# EAGLE design tfcart (EAGLE 9.6.2)
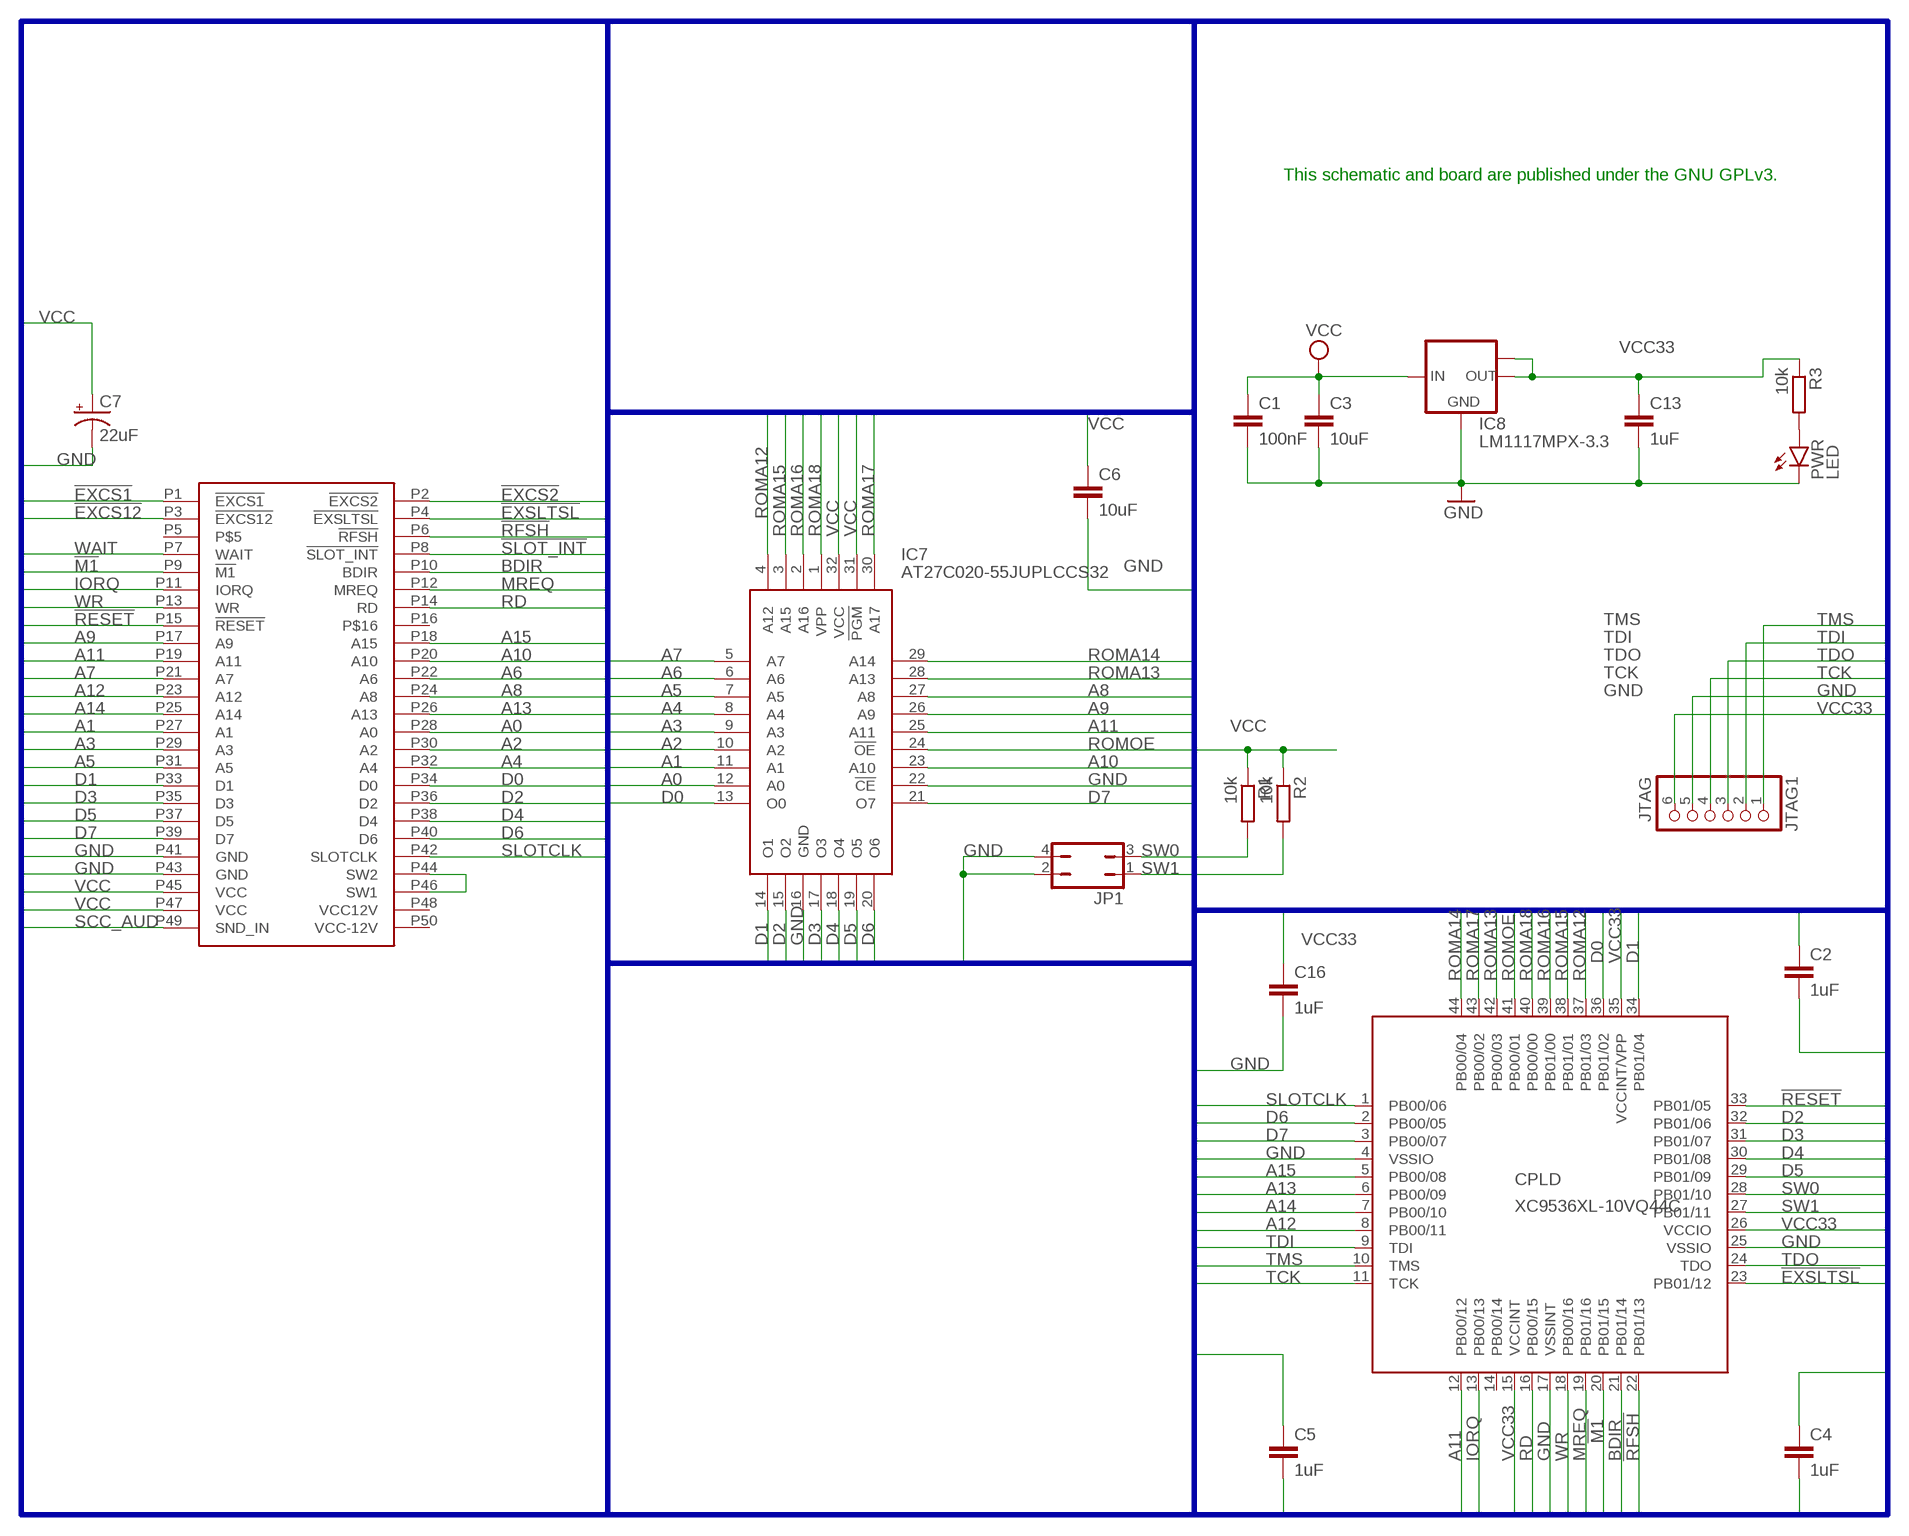
[diagram p0: schematic, sheet 1]

## Parts
C1  100nF  C-EUC1206  [C1206]
C2  1uF  CC0603  [C0603]
C3  10uF  CC0603  [C0603]
C4  1uF  CC0603  [C0603]
C5  1uF  CC0603  [C0603]
C6  10uF  CC0603  [C0603]
C7  22uF  CPOL-USB  [PANASONIC_B]
C13  1uF  C-EUC1206  [C1206]
C16  1uF  CC0603  [C0603]
CN1  MSX_CART  [MSX_CART]
CPLD  XC9536XL-10VQ44C  XC9536_44VQ  [SQFP-S-10X10-44]
IC7  AT27C020-55JUPLCCS32  [PLCC-S32]
IC8  LM1117MPX-3.3  [SOT223]
JP1  JP2Q  [JP2Q]
JTAG1  JTAG  HEADER-1X6ROUND  [1X06_ROUND]
PWR  LED  LEDSML0805  [SML0805]
R1  10k  R-EU_R0603  [R0603]
R2  10k  R-EU_R0603  [R0603]
R3  10k  R-EU_R0603  [R0603]

## Nets
!EXCS1: CN1.P1(!EXCS1)
!EXCS2: CN1.P2(!EXCS2)
!EXCS12: CN1.P3(!EXCS12)
!EXSLTSL: CN1.P4(!EXSLTSL) CPLD.23(PB01/12)
!M1: CN1.P9(!M1) CPLD.20(PB01/15)
!RESET: CN1.P15(!RESET) CPLD.33(PB01/05)
!RFSH: CN1.P6(!RFSH) CPLD.22(PB01/13)
!SLOT_INT: CN1.P8(!SLOT_INT)
A0: CN1.P28(A0) IC7.12(A0)
A1: CN1.P27(A1) IC7.11(A1)
A2: CN1.P30(A2) IC7.10(A2)
A3: CN1.P29(A3) IC7.9(A3)
A4: CN1.P32(A4) IC7.8(A4)
A5: CN1.P31(A5) IC7.7(A5)
A6: CN1.P22(A6) IC7.6(A6)
A7: CN1.P21(A7) IC7.5(A7)
A8: CN1.P24(A8) IC7.27(A8)
A9: CN1.P17(A9) IC7.26(A9)
A10: CN1.P20(A10) IC7.23(A10)
A11: CN1.P19(A11) CPLD.12(PB00/12) IC7.25(A11)
A12: CN1.P23(A12) CPLD.8(PB00/11)
A13: CN1.P26(A13) CPLD.6(PB00/09)
A14: CN1.P25(A14) CPLD.7(PB00/10)
A15: CN1.P18(A15) CPLD.5(PB00/08)
BDIR: CN1.P10(BDIR) CPLD.21(PB01/14)
D0: CN1.P34(D0) CPLD.36(PB01/02) IC7.13(O0)
D1: CN1.P33(D1) CPLD.34(PB01/04) IC7.14(O1)
D2: CN1.P36(D2) CPLD.32(PB01/06) IC7.15(O2)
D3: CN1.P35(D3) CPLD.31(PB01/07) IC7.17(O3)
D4: CN1.P38(D4) CPLD.30(PB01/08) IC7.18(O4)
D5: CN1.P37(D5) CPLD.29(PB01/09) IC7.19(O5)
D6: CN1.P40(D6) CPLD.2(PB00/05) IC7.20(O6)
D7: CN1.P39(D7) CPLD.3(PB00/07) IC7.21(O7)
GND: C1.2 C2.2 C3.2 C4.2 C5.2 C6.2 C7.- C13.2 C16.2 CN1.P41(GND) CN1.P43(GND) CPLD.4(VSSIO) CPLD.17(VSSINT) CPLD.25(VSSIO) IC7.16(GND) IC7.22(!CE) IC8.1(GND) JP1.2 JP1.4 JTAG1.5 PWR.C
IORQ: CN1.P11(IORQ) CPLD.13(PB00/13)
MREQ: CN1.P12(MREQ) CPLD.19(PB01/16)
N$2: CN1.P44(SW2) CN1.P46(SW1)
N$18: PWR.A R3.2
RD: CN1.P14(RD) CPLD.16(PB00/15)
ROMA12: CPLD.37(PB01/03) IC7.4(A12)
ROMA13: CPLD.42(PB00/03) IC7.28(A13)
ROMA14: CPLD.44(PB00/04) IC7.29(A14)
ROMA15: CPLD.38(PB01/01) IC7.3(A15)
ROMA16: CPLD.39(PB01/00) IC7.2(A16)
ROMA17: CPLD.43(PB00/02) IC7.30(A17)
ROMA18: CPLD.40(PB00/00) IC7.1(VPP)
ROMOE: CPLD.41(PB00/01) IC7.24(!OE)
SCC_AUD: CN1.P49(SND_IN)
SLOTCLK: CN1.P42(SLOTCLK) CPLD.1(PB00/06)
SW0: CPLD.28(PB01/10) JP1.3 R1.2
SW1: CPLD.27(PB01/11) JP1.1 R2.2
TCK: CPLD.11(TCK) JTAG1.4
TDI: CPLD.9(TDI) JTAG1.2
TDO: CPLD.24(TDO) JTAG1.3
TMS: CPLD.10(TMS) JTAG1.1
VCC: C1.1 C3.1 C6.1 C7.+ CN1.P45(VCC) CN1.P47(VCC) IC7.31(!PGM) IC7.32(VCC) IC8.3(IN) R1.1 R2.1
VCC33: C2.1 C4.1 C5.1 C13.1 C16.1 CPLD.15(VCCINT) CPLD.26(VCCIO) CPLD.35(VCCINT/VPP) IC8.2(OUT) IC8.TAB(OUT1) JTAG1.6 R3.1
WAIT: CN1.P7(WAIT)
WR: CN1.P13(WR) CPLD.18(PB00/16)
Unconnected: CN1.P5 CN1.P16 CN1.P48(VCC12V) CN1.P50(VCC-12V) CPLD.14(PB00/14)

## Buses
A[0..15],BDIR,D[0..7],!EXCS[1..2],!EXCS12,!EXSLTSL,GND,HALT,!INT,IORQ,!M1,MREQ,RD,!RESET,!RFSH,ROMA[12..18],ROMCE,ROMOE,SCC_AUD,SLOTCLK,SLOTCLK_CLEAN,!SLOT_INT,SW[0..1],TCK,TDI,TDINT,TDO,TMS,VCC,VCC-12V,VCC12V,VCC33,WAIT,WR

## Notes on the sheet
- This schematic and board are published under the GNU GPLv3.

## Library data of the parts
C1 C13 = rcl:C-EU: CAPACITOR, European symbol; SPICEPREFIX: C
C2-C6 C16 = eagle-ltspice:C: CAPACITOR, European symbol; SPICEMODEL: NONE; SPICEPREFIX: C
C7 = rcl:CPOL-US: POLARIZED CAPACITOR, American symbol; SPICEPREFIX: C
CN1 = Amiga:MSX_CART: Expansion Port for CDTV and A570
CPLD = xilinx-xc9:XC9536_44VQ: xc9536_pc44 XC9500 In-System Programmable CPLD Family Auto generated by make-symbol-device-package-bsdl.ulp Rev. 34 Source: xc9536_vq44.bsd; MPN: XC9536-15VQG44C; OC_FARNELL: 1193227; OC_NEWARK: 98K3377
IC7 = SamacSys_Parts:AT27C020-55JU: AT27C020-55JU, OTP EPROM Memory 2Mbit 256K x 8 bit 55ns, 5.0V 32-Pin PLCC Source: Datasheet
IC8 = lm1117:LM1117MPX-*
JP1 = jumper:JP2Q: JUMPER
JTAG1 = microbuilder:HEADER-1X6: PIN HEADER
PWR = led:LED: LED OSRAM: - CHIPLED LG R971, LG N971, LY N971, LG Q971, LY Q971, LO R971, LY R971 LH N974, LH R974 LS Q976, LO Q976, LY Q976 LO Q996 - Hyper CHIPLED LW Q18S LB Q993, LB Q99A, LB R99A - SideLED LS A670, LO A670, LY A670, LG A670, LP A670 LB A673, LV A673, LT A673, LW A673 LH A674 LY A675 LS A676, LA A676, LO A676, LY A676, LW A676 LS A679, LY A679, LG A679 - Hyper Micro SIDELED® LS Y876, LA Y876, LO Y876, LY Y876 LT Y87S - SmartLED LW L88C, LW L88S LB L89C, LB L89S, LG L890 LS L89K, LO L89K, LY L89K LS L896, LA L896, LO L896, LY L896 - TOPLED LS T670, LO T670, LY T670, LG T670, LP T670 LSG T670, LSP T670, LSY T670, LOP T670, LYG T670 LG T671, LOG T671, LSG T671 LB T673, LV T673, LT T673, LW T673 LH T674 LS T676, LA T676, LO T676, LY T676, LB T676, LH T676, LSB T676, LW T676 LB T67C, LV T67C, LT T67C, LS T67K, LO T67K, LY T67K, LW E67C LS E67B, LA E67B, LO E67B, LY E67B, LB E67C, LV E67C, LT E67C LW T67C LS T679, LY T679, LG T679 LS T770, LO T770, LY T770, LG T770, LP T770 LB T773, LV T773, LT T773, LW T773 LH T774 LS E675, LA E675, LY E675, LS T675 LS T776, LA T776, LO T776, LY T776, LB T776 LHGB T686 LT T68C, LB T68C - Hyper Mini TOPLED® LB M676 - Mini TOPLED Santana® LG M470 LS M47K, LO M47K, LY M47K Source: http://www.osram.convergy.de LUXEON: - LUMILED® LXK2-PW12-R00, LXK2-PW12-S00, LXK2-PW14-U00, LXK2-PW14-V00 LXK2-PM12-R00, LXK2-PM12-S00, LXK2-PM14-U00 LXK2-PE12-Q00, LXK2-PE12-R00, LXK2-PE12-S00, LXK2-PE14-T00, LXK2-PE14-U00 LXK2-PB12-K00, LXK2-PB12-L00, LXK2-PB12-M00, LXK2-PB14-N00, LXK2-PB14-P00, LXK2-PB14-Q00 LXK2-PR12-L00, LXK2-PR12-M00, LXK2-PR14-Q00, LXK2-PR14-R00 LXK2-PD12-Q00, LXK2-PD12-R00, LXK2-PD12-S00 LXK2-PH12-R00, LXK2-PH12-S00 LXK2-PL12-P00, LXK2-PL12-Q00, LXK2-PL12-R00 Source: www.luxeon.com KINGBRIGHT: KA-3528ASYC Source: www.kingbright.com
R1-R3 = rcl:R-EU_: RESISTOR, European symbol; SPICEPREFIX: R

## Net classes
0 default: width 0.152 mm, drill 0.3 mm, clearance 0.152 mm

## Board
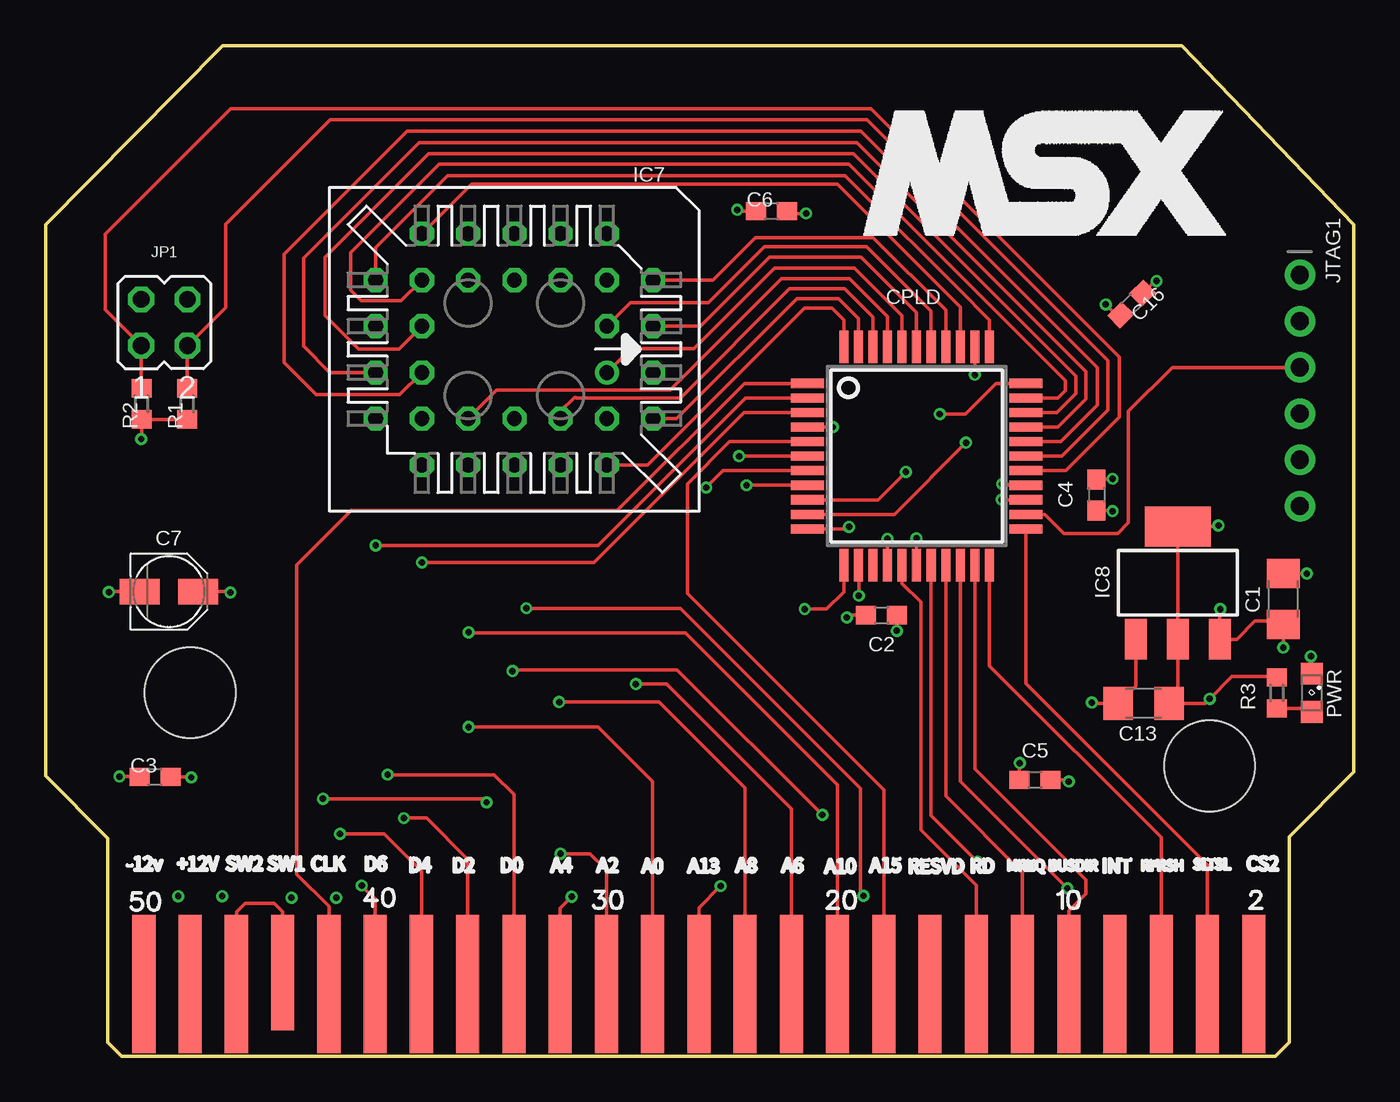
[diagram p1: board, top side]
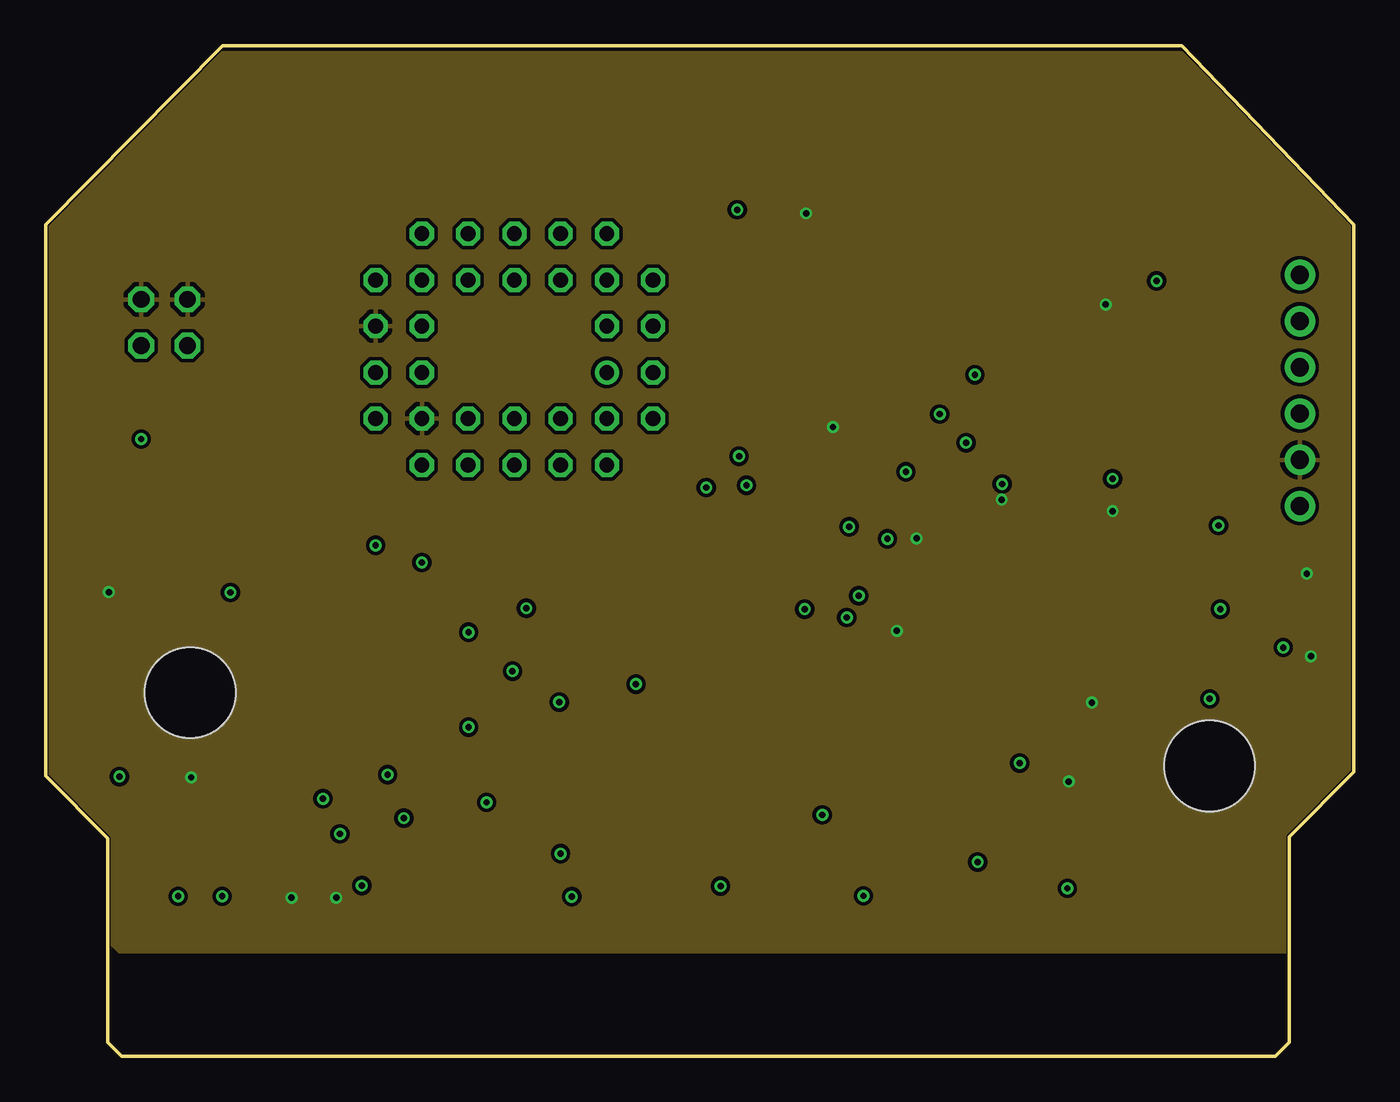
[diagram p2: board, inner layer Route2]
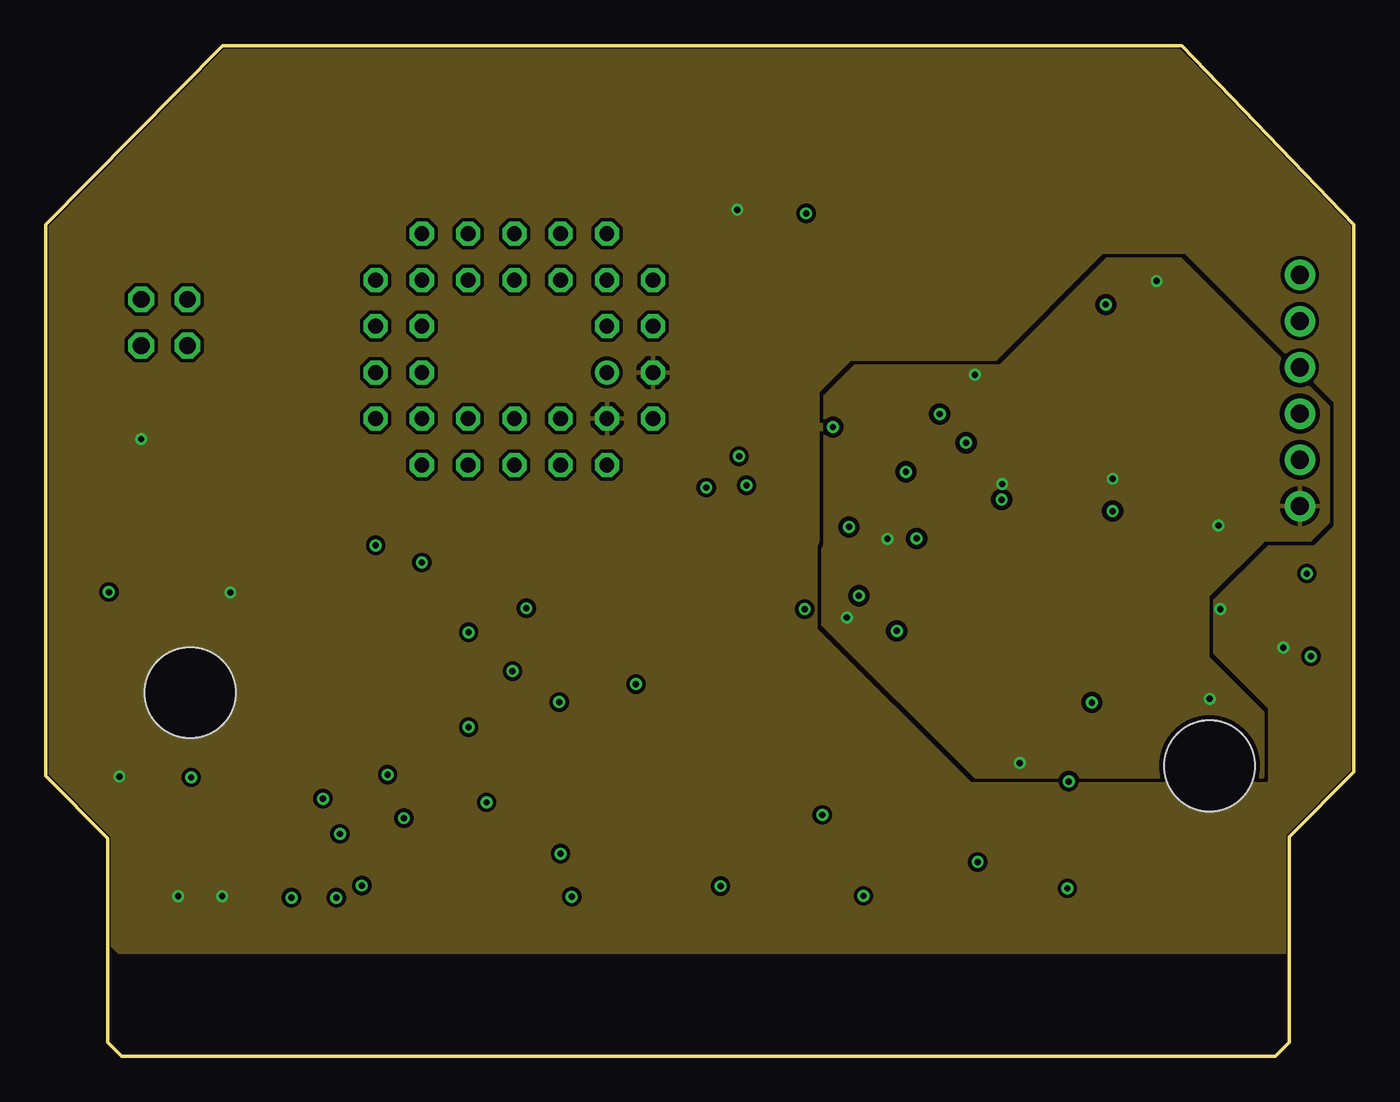
[diagram p3: board, inner layer Route15]
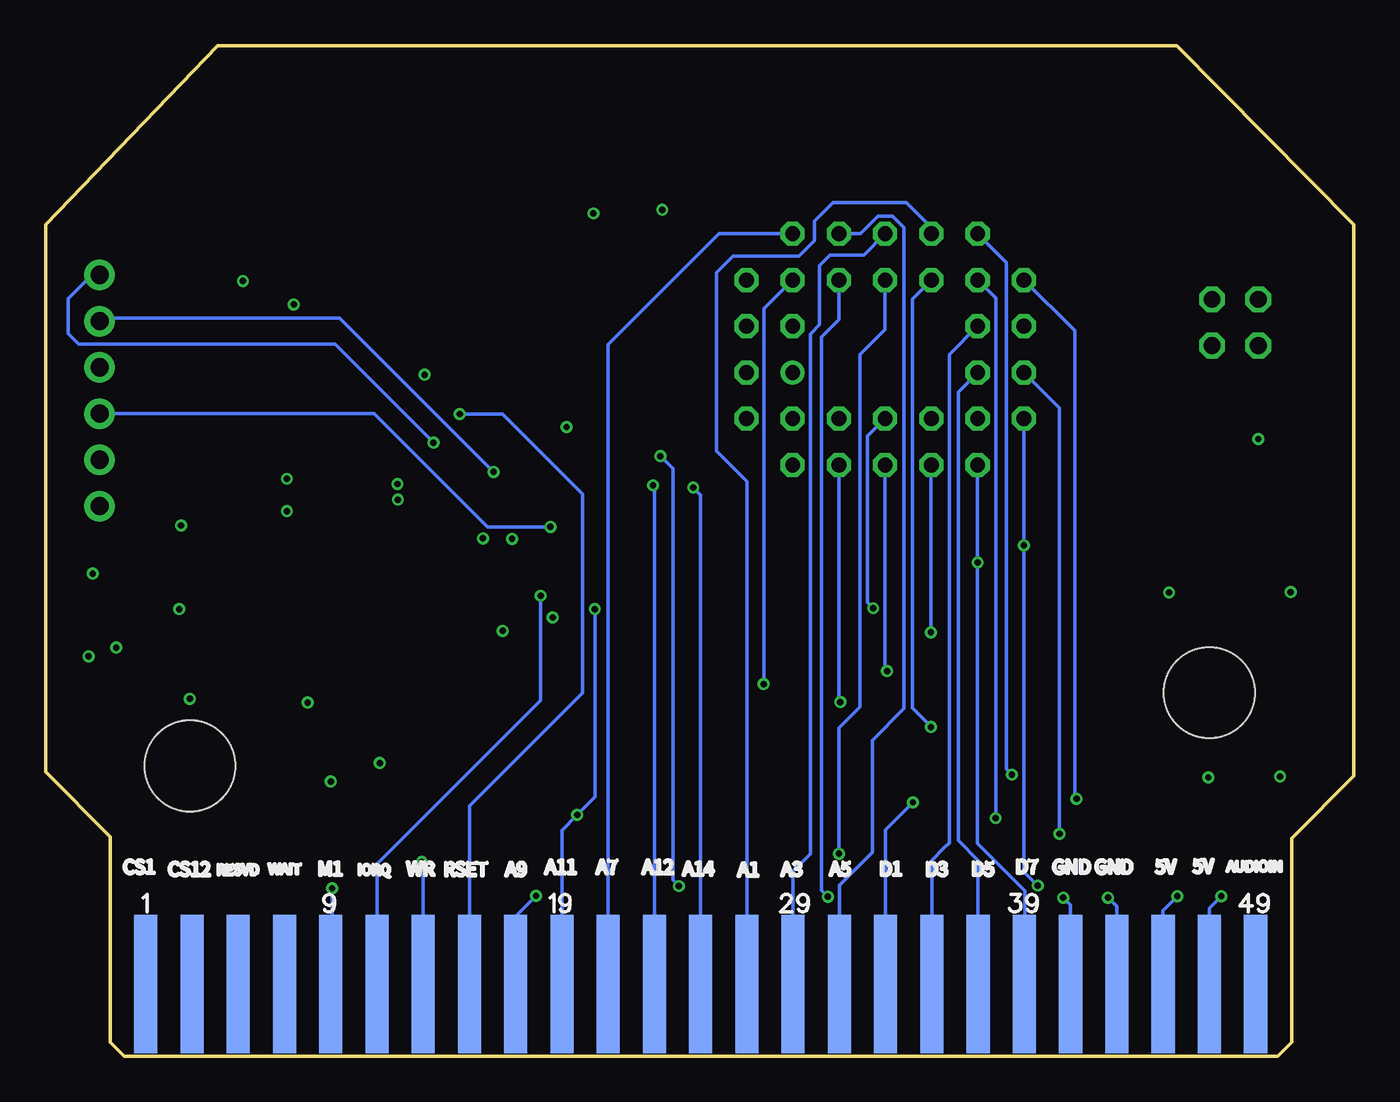
[diagram p4: board, bottom side, seen from below]

Size 71.88 x 55.53 mm. Coordinates in mm from the lower left corner, seen from the top.
Outline: 0,45.69 9.73,55.53 62.43,55.53 71.88,45.69 71.88,15.62 68.33,12.06 68.33,0.76 67.56,0 4.19,0 3.43,0.76 3.43,11.96 0,15.39 0,45.69
Copper layers (1*2*15*16): Top 0.035mm / dielectric 1.5mm / Route2 0.0175mm / dielectric 1.1mm / Route15 0.0175mm / dielectric 0.2mm / Bottom 0.035mm
Design rules "dirt_cheap_dirty_boards.v1 (1) *": minimum track width 6mil, minimum drill 12mil, track to track 8mil, track to pad 8mil, pad to pad 8mil, via to via 8mil, smd to smd 0mil, copper to edge 2mil, drill to drill 10mil, minimum pad ring 10mil, minimum via ring 6mil, stop-mask expansion 2mil, vias tented up to drill 25mil, thermal gap 10mil
Holes 5 mm at 7.95,19.97 63.95,15.96

### Footprints (pad centres in the part's own frame; a part is rotated, then mirrored left to right if it is on the bottom)
C1206 = smd 1.6 x 1.8: 1 -1.4,0; 2 1.4,0
C0603 = smd 1.1 x 1: 1 -0.85,0; 2 0.85,0
PANASONIC_B = smd 2.2 x 1.4: + 1.6,0; - -1.6,0
MSX_CART = smd 1.27 x 7.62 bottom: P1 63.5,5.08; P3 60.96,5.08; P5 58.42,5.08; P7 55.88,5.08; P9 53.34,5.08; P11 50.8,5.08; P13 48.26,5.08; P15 45.72,5.08; P17 43.18,5.08; P19 40.64,5.08; P21 38.1,5.08; P23 35.56,5.08; P25 33.02,5.08; P27 30.48,5.08; P29 27.94,5.08; P31 25.4,5.08; P33 22.86,5.08; P35 20.32,5.08; P37 17.78,5.08; P39 15.24,5.08; P41 12.7,5.08; P43 10.16,5.08; P45 7.62,5.08; P47 5.08,5.08; P49 2.54,5.08 | smd 1.27 x 7.62: P2 63.5,5.08; P4 60.96,5.08; P6 58.42,5.08; P8 55.88,5.08; P10 53.34,5.08; P12 50.8,5.08; P14 48.26,5.08; P16 45.72,5.08; P18 43.18,5.08; P20 40.64,5.08; P22 38.1,5.08; P24 35.56,5.08; P26 33.02,5.08; P28 30.48,5.08; P30 27.94,5.08; P32 25.4,5.08; P34 22.86,5.08; P36 20.32,5.08; P38 17.78,5.08; P40 15.24,5.08; P42 12.7,5.08; P46 7.62,5.08; P48 5.08,5.08; P50 2.54,5.08 | smd 1.27 x 6.35: P44 10.16,5.715
SQFP-S-10X10-44 = smd 0.5 x 1.8: 1 -4,-6; 2 -3.2,-6; 3 -2.4,-6; 4 -1.6,-6; 5 -0.8,-6; 6 0,-6; 7 0.8,-6; 8 1.6,-6; 9 2.4,-6; 10 3.2,-6; 11 4,-6; 23 4,6; 24 3.2,6; 25 2.4,6; 26 1.6,6; 27 0.8,6; 28 0,6; 29 -0.8,6; 30 -1.6,6; 31 -2.4,6; 32 -3.2,6; 33 -4,6 | smd 1.8 x 0.5: 12 6,-4; 13 6,-3.2; 14 6,-2.4; 15 6,-1.6; 16 6,-0.8; 17 6,0; 18 6,0.8; 19 6,1.6; 20 6,2.4; 21 6,3.2; 22 6,4; 34 -6,4; 35 -6,3.2; 36 -6,2.4; 37 -6,1.6; 38 -6,0.8; 39 -6,0; 40 -6,-0.8; 41 -6,-1.6; 42 -6,-2.4; 43 -6,-3.2; 44 -6,-4
PLCC-S32 = drill 0.813: 1 1.27,5.08 | drill 0.813 octagon: 2 -1.27,7.62; 3 -1.27,5.08; 4 -3.81,7.62; 5 -6.35,5.08; 6 -3.81,5.08; 7 -6.35,2.54; 8 -3.81,2.54; 9 -6.35,0; 10 -3.81,0; 11 -6.35,-2.54; 12 -3.81,-2.54; 13 -6.35,-5.08; 14 -3.81,-7.62; 15 -3.81,-5.08; 16 -1.27,-7.62; 17 -1.27,-5.08; 18 1.27,-7.62; 19 1.27,-5.08; 20 3.81,-7.62; 21 6.35,-5.08; 22 3.81,-5.08; 23 6.35,-2.54; 24 3.81,-2.54; 25 6.35,0; 26 3.81,0; 27 6.35,2.54; 28 3.81,2.54; 29 6.35,5.08; 30 3.81,7.62; 31 3.81,5.08; 32 1.27,7.62
SOT223 = smd 1.219 x 2.235: 1 -2.311,-3.099; 2 0,-3.099; 3 2.311,-3.099 | smd 3.6 x 2.2: TAB 0,3.099
JP2Q = drill 0.914 octagon: 1 -1.27,-1.27; 2 -1.27,1.27; 3 1.27,-1.27; 4 1.27,1.27
1X06_ROUND = drill 1 pad 1.676: 1 -6.35,0; 2 -3.81,0; 3 -1.27,0; 4 1.27,0; 5 3.81,0; 6 6.35,0
SML0805 = smd 1.2 x 1.2: A 1.05,0; C -1.05,0
R0603 = smd 1 x 1.1: 1 -0.85,0; 2 0.85,0

### Placement (x,y rotation side)
C1  68,25.12 90 top
C2  45.92,24.23 0 top
C3  6.02,15.34 0 top
C4  57.73,30.84 270 top
C5  54.36,15.19 0 top
C6  39.88,46.43 0 top
C7  6.78,25.53 0 top
C13  60.33,19.38 180 top
C16  59.66,41.33 225 top
CN1  2.87,-1.12 0 top
CPLD  47.85,32.97 270 top
IC7  25.76,38.84 270 top
IC8  62.2,26.01 0 top
JP1  6.53,40.31 0 top
JTAG1  68.91,36.58 270 top
PWR  69.57,19.96 270 top
R1  7.77,35.84 90 top
R2  5.28,35.84 90 top
R3  67.64,19.96 270 top

### Tracks (layer width: path | path; a pad name or v marks a point on that pad's centre or on a via)
!EXSLTSL
  Top 0.203: CN1.P4 63.83,10.52 53.85,20.49 CPLD.23
!M1  (via drill 0.35)
  Top 0.203: CPLD.20 50.25,15.1 v56.13,9.22
  Bottom 0.203: v56.13,9.22 56.13,4.01 CN1.P9
!RESET  (via drill 0.35)
  Top 0.203: CPLD.33 52.22,36.97 50.53,35.28 v49.12,35.28
  Bottom 0.203: CN1.P15 48.59,13.77 42.39,19.96 42.39,30.89 46.79,35.28 v49.12,35.28
!RFSH
  Top 0.203: CN1.P6 61.29,12.01 51.85,21.45 CPLD.22
A0  (via drill 0.35)
  Top 0.203: CN1.P28 33.35,15.09 30.35,18.08 v23.24,18.08
  Bottom 0.203: IC7.12 24.26,41.61 24.26,19.13 23.24,18.11 v23.24,18.08
A1
  Bottom 0.203: IC7.11 23.22,45.52 24.59,46.89 28.63,46.89 29.64,45.87 29.64,44.81 30.48,43.97 34.11,43.97 35.03,43.05 35.03,33.25 33.35,31.57 CN1.P27
A2  (via drill 0.35)
  Top 0.203: CN1.P30 30.81,10.24 29.92,11.13 v28.3,11.13
  Bottom 0.203: IC7.10 25.76,39.93 27.13,38.56 27.13,19.2 28.3,18.03 v28.3,11.13
A3
  Bottom 0.203: IC7.9 26.92,44.02 28.78,44.02 29.36,43.43 29.36,40.18 29.87,39.67 29.87,11.13 30.81,10.19 CN1.P29
A4  (via drill 0.35)
  Top 0.203: v28.91,8.76 28.27,8.13 CN1.P32
  Bottom 0.203: IC7.8 28.3,40.48 29.26,39.51 29.26,9.12 v28.91,8.76
A5
  Bottom 0.203: IC7.7 27.12,45.19 26.16,46.15 25.36,46.15 24.71,45.51 24.71,19.1 26.47,17.35 26.47,11.2 28.27,9.4 CN1.P31
A6  (via drill 0.35)
  Top 0.203: v32.44,20.45 34.11,20.45 40.97,13.59 CN1.P22
  Bottom 0.203: IC7.6 32.41,41.07 32.41,20.47 v32.44,20.45
A7
  Bottom 0.203: IC7.5 34.87,45.19 40.97,39.09 CN1.P21
A8  (via drill 0.35)
  Top 0.203: v28.22,19.46 33.71,19.46 38.43,14.73 CN1.P24
  Bottom 0.203: IC7.27 28.3,19.53 v28.22,19.46
A9  (via drill 0.35)
  Top 0.203: v26.41,24.61 34.87,24.61 44.78,14.71 44.78,8.97 v44.93,8.81
  Bottom 0.203: IC7.26 26.72,34.06 26.72,24.92 v26.41,24.61 | v44.93,8.81 46.05,7.7 CN1.P17
A10  (via drill 0.35)
  Top 0.203: v23.24,23.29 23.27,23.27 35.15,23.27 43.51,14.91 CN1.P20
  Bottom 0.203: IC7.23 23.24,32.46 v23.24,23.29
A11  (via drill 0.35)
  Top 0.203: v25.65,21.16 25.73,21.23 34.7,21.23 v42.67,13.26 | CPLD.12 43.85,25.51 42.9,24.56 v41.71,24.56
  Bottom 0.203: IC7.25 25.76,21.26 v25.65,21.16 | CN1.P19 43.51,12.42 v42.67,13.26 41.68,14.25 41.68,24.54 v41.71,24.56
A12  (via drill 0.35)
  Top 0.203: v38.51,31.37 CPLD.8
  Bottom 0.203: CN1.P23 38.43,31.29 v38.51,31.37
A13  (via drill 0.35)
  Top 0.203: CPLD.6 v38.1,32.97 | v37.08,9.35 35.89,8.15 CN1.P26
  Bottom 0.203: v38.1,32.97 37.41,32.28 37.41,9.68 v37.08,9.35
A14  (via drill 0.35)
  Top 0.203: CPLD.7 37.22,32.17 v36.3,31.24
  Bottom 0.203: v36.3,31.24 35.89,30.84 CN1.P25
A15
  Top 0.203: CPLD.5 37.58,33.77 35.26,31.45 35.26,25.43 46.05,14.63 CN1.P18
BDIR
  Top 0.203: CPLD.21 51.05,15.77 57.15,9.68 57.15,8.92 56.21,7.98 CN1.P10
D0  (via drill 0.35)
  Top 0.203: v18.8,15.47 24.64,15.47 25.73,14.38 CN1.P34 | IC7.13 23.39,47.9 43.51,47.9 50.25,41.16 CPLD.36
  Bottom 0.203: IC7.13 19.1,43.61 19.1,15.77 v18.8,15.47
D1  (via drill 0.35)
  Top 0.203: v24.23,13.94 24.03,14.15 v15.24,14.15 | IC7.14 18.14,44.42 22.1,48.39 43.92,48.39 50.97,41.34 51.05,41.25 51.85,40.45 CPLD.34
  Bottom 0.203: IC7.14 15.34,39.85 15.34,14.25 v15.24,14.15 | v24.23,13.94 25.73,12.45 CN1.P33
D2  (via drill 0.35)
  Top 0.203: v19.69,13.08 20.93,13.08 23.19,10.82 CN1.P36 | IC7.15 19.53,41.5 17.35,41.5 16.76,42.09 16.76,44.15 21.62,49 44.15,49 56.03,37.11 56.03,36.58 55.63,36.17 CPLD.32
  Bottom 0.203: IC7.15 19.69,41.66 v19.69,13.08
D3
  Top 0.203: IC7.17 19.43,38.86 17.2,38.86 15.37,40.69 15.37,43.89 21.06,49.58 44.37,49.58 56.59,37.36 56.59,36.4 55.56,35.37 CPLD.31
  Bottom 0.203: IC7.17 22.23,38.56 22.23,11.73 22.54,11.42 23.19,10.77 CN1.P35
D4  (via drill 0.35)
  Top 0.203: v16.18,12.22 18.59,12.22 20.65,10.16 CN1.P38 | IC7.18 15.62,37.57 14.17,39.01 14.17,43.84 20.52,50.19 44.58,50.19 57.15,37.62 57.15,36.09 55.63,34.57 CPLD.30
  Bottom 0.203: IC7.18 16.18,35.61 v16.18,12.22
D5
  Top 0.203: IC7.19 19.46,36.35 14.87,36.35 13.11,38.11 13.11,44.07 19.86,50.83 44.81,50.83 57.79,37.85 57.79,35.76 55.79,33.77 CPLD.29
  Bottom 0.203: CN1.P37 20.65,10.77 21.74,11.86 21.74,36.5 IC7.19
D6  (via drill 0.35)
  Top 0.203: v17.37,9.37 18.11,8.64 CN1.P40 | CPLD.2 38.46,36.17 30.35,28.07 v18.14,28.07
  Bottom 0.203: IC7.20 v18.14,28.07 18.14,10.13 v17.37,9.37
D7  (via drill 0.35)
  Top 0.203: CPLD.3 38.37,35.37 30.12,27.13 v20.68,27.13
  Bottom 0.203: IC7.21 v20.68,27.13 20.68,11.68 18.09,9.09 18.09,3.96 CN1.P39
GND  (via drill 0.35)
  Top 0.203: IC8.1 59.89,20.35 C13.2 57.53,19.38 v57.48,19.43 | v43.26,34.57 CPLD.4 | v43.26,34.57 | CPLD.25 52.54,30.57 v52.53,30.58 | CPLD.17 v47.85,28.45 | C2.2 v46.77,23.38 v46.76,23.37 | C16.2 58.82,40.72 v58.24,41.3 | C4.2 58.58,29.99 v58.62,29.95 | C5.2 56.11,15.19 v56.21,15.09 | C3.2 7.98,15.34 v8,15.32 | PWR.C 69.57,21.92 v69.52,21.97 | C1.2 v69.29,26.52 | C6.2 40.86,46.3 v41.78,46.3 | C7.- 3.51,25.53 v3.48,25.5
  Bottom 0.203: CN1.P43 13.03,8.23 v13.51,8.71 | CN1.P41 15.57,8.31 v15.98,8.71
  pour Route2: 0.03,45.75 0.03,15.01 3.45,11.58 3.45,6.32 4.04,5.74 68.33,5.74 68.33,11.66 71.91,15.24 71.96,45.69 62.43,55.14 9.43,55.14
IORQ  (via drill 0.35)
  Top 0.203: v44.68,25.3 44.68,26.94 CPLD.13
  Bottom 0.203: CN1.P11 53.67,10.57 44.68,19.56 v44.68,25.3
MREQ
  Top 0.203: CPLD.19 49.45,14.3 53.67,10.08 CN1.P12
N$2
  Top 0.203: CN1.P46 10.49,7.92 10.97,8.41 12.55,8.41 13.03,7.92 CN1.P44
N$18
  Top 0.203: PWR.A 69.37,19.11 R3.2
RD
  Top 0.203: CN1.P14 51.13,9.4 48.08,12.45 48.08,24.94 47.05,25.97 CPLD.16
ROMA12
  Top 0.203: CPLD.37 49.45,41 45.47,44.98 39.01,44.98 36.68,42.65 IC7.4
ROMA13
  Top 0.203: CPLD.42 45.45,40.6 43.89,42.16 40.87,42.16 34.87,36.17 29.16,36.17 29.13,36.19 29.06,36.19 28.3,35.43 IC7.28
ROMA14
  Top 0.203: IC7.29 33.07,32.49 41.68,41.1 43.21,41.1 43.85,40.45 CPLD.44
ROMA15
  Top 0.203: IC7.3 32.13,41.4 36.42,41.4 39.5,44.48 45.11,44.48 48.65,40.93 CPLD.38
ROMA16
  Top 0.203: IC7.2 35.99,40.11 39.78,43.89 44.81,43.89 47.85,40.84 CPLD.39
ROMA17
  Top 0.203: IC7.30 34.67,35.03 41.28,41.63 43.56,41.63 44.65,40.54 CPLD.43
ROMA18
  Top 0.203: IC7.1 32.16,38.89 35.64,38.89 40.06,43.31 44.45,43.31 47.05,40.7 CPLD.40
ROMOE
  Top 0.203: CPLD.41 46.25,40.64 44.17,42.72 40.44,42.72 34.32,36.6 24.79,36.6 IC7.24
SLOTCLK
  Top 0.203: CPLD.1 38.39,36.97 31.39,29.97 16.79,29.97 13.79,26.97 13.79,10 15.57,8.22 CN1.P42
SW0
  Top 0.203: CPLD.28 55.83,32.97 58.37,35.51 58.37,38.23 45.14,51.46 15.65,51.46 9.89,45.71 9.89,41.14 JP1.3 7.77,39.01 R1.2
SW1
  Top 0.203: CPLD.27 56.05,32.17 59,35.13 59,38.4 45.34,52.07 10.19,52.07 3.28,45.16 3.28,41.02 JP1.1 5.26,36.71 R2.2
TCK  (via drill 0.35)
  Top 0.203: v44.15,29.08 44.03,28.97 CPLD.11
  Bottom 0.203: JTAG1.4 53.82,35.31 47.6,29.08 v44.15,29.08
TDI  (via drill 0.35)
  Top 0.203: v47.27,32.11 45.73,30.57 CPLD.9
  Bottom 0.203: JTAG1.2 68.74,40.56 55.73,40.56 v47.27,32.11
TDO
  Top 0.203: CPLD.24 54.89,29.77 55.93,28.73 58.9,28.73 59.49,29.31 59.49,35.43 61.9,37.85 JTAG1.3
TMS  (via drill 0.35)
  Top 0.203: v50.57,33.71 46.64,29.77 CPLD.10
  Bottom 0.203: v50.57,33.71 55.98,39.12 70.05,39.12 70.64,39.7 70.64,41.63 69.34,42.93 JTAG1.1
VCC  (via drill 0.35)
  Top 0.203: v64.54,24.56 64.52,24.54 IC8.3 65.46,22.91 66.45,23.9 67.82,23.9 C1.1 v68,22.45 | C3.1 5.14,15.37 v4.06,15.37 | R1.1 R2.1 5.28,33.93 v5.26,33.91 | C6.1 38.07,46.43 v38,46.51 | C7.+ 10.11,25.53 v10.16,25.48
  Bottom 0.203: CN1.P47 7.95,7.9 7.95,8.13 v7.29,8.79 | CN1.P45 10.49,8 v9.7,8.79
  pour Route15 (rank 2): 0.03,45.69 0.03,15.27 3.45,11.84 3.45,6.27 4.01,5.71 68.15,5.71 68.35,5.92 68.35,11.94 71.91,15.49 71.91,45.64 62.15,55.4 9.73,55.4
VCC33  (via drill 0.35)
  Top 0.203: C2.1 44.15,24.23 v44.02,24.1 | C16.1 60.93,42.6 v61.04,42.6 | C4.1 57.77,31.72 v58.62,31.72 | C5.1 53.51,16.09 v53.52,16.1 | R3.1 67.6,20.85 65.18,20.85 v63.96,19.63 63.7,19.38 C13.1 62.2,19.86 IC8.2 IC8.TAB 64.39,29.11 v64.44,29.16 | CPLD.15 v46.25,28.42 | v46.25,28.42 | CPLD.26 52.62,31.37 v52.55,31.44 | CPLD.35 v51.05,37.44
  pour Route15 (isolate 0.254): 42.82,28.09 42.82,36.27 44.48,37.92 52.45,37.92 58.32,43.79 62.36,43.79 70.46,35.69 70.46,29.34 69.49,28.37 66.95,28.37 63.86,25.27 63.86,21.92 66.88,18.9 66.88,15.34 51.08,15.34 42.72,23.7 42.72,27.84 42.75,27.86
WR  (via drill 0.35)
  Top 0.203: v51.21,10.67 49.5,12.37 49.45,12.42 48.65,13.22 CPLD.18
  Bottom 0.203: CN1.P13 51.13,10.59 v51.21,10.67